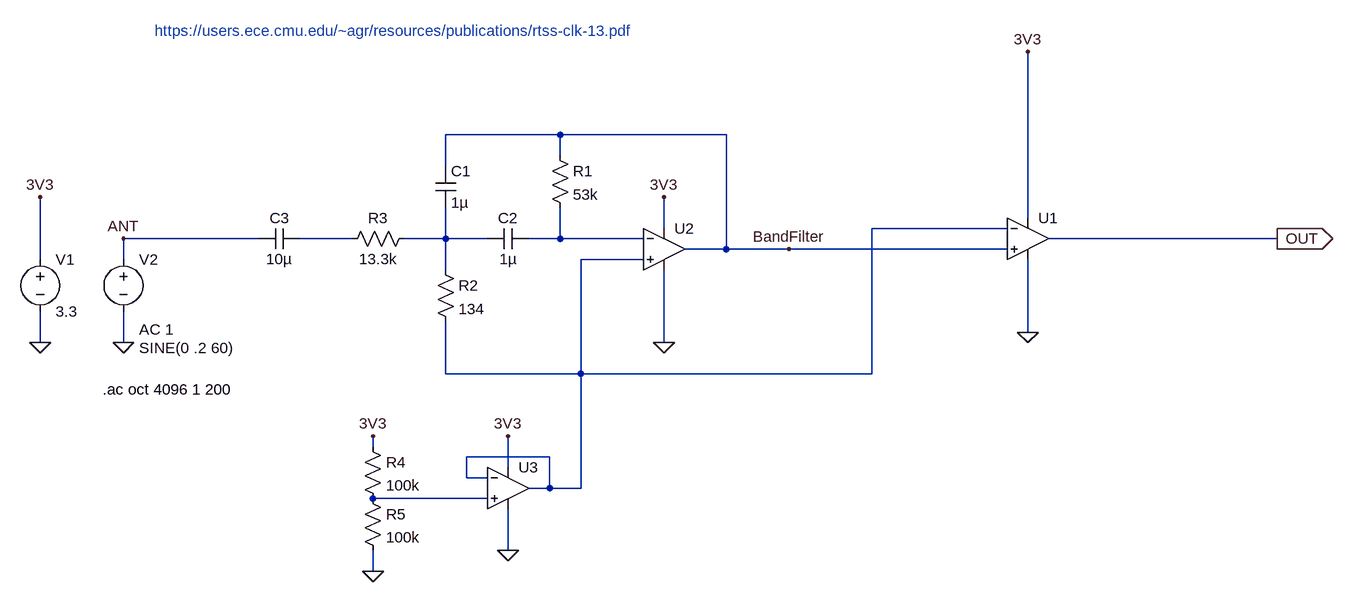
[diagram p0: schematic 60Hz Detector Simulation - Frequency Resp.asc]
60Hz Detector Simulation - Frequency Resp.asc, the LTspice schematic file:
Version 4
SHEET 1 900 836
WIRE -320 112 -496 112
WIRE -64 112 -320 112
WIRE -320 144 -320 112
WIRE -496 160 -496 112
WIRE 400 240 400 -16
WIRE -160 256 -160 208
WIRE 368 256 160 256
WIRE -784 272 -992 272
WIRE -640 272 -720 272
WIRE -496 272 -496 224
WIRE -496 272 -560 272
WIRE -432 272 -496 272
WIRE -320 272 -320 224
WIRE -320 272 -368 272
WIRE -192 272 -320 272
WIRE 784 272 432 272
WIRE -64 288 -64 112
WIRE -64 288 -128 288
WIRE 32 288 -64 288
WIRE 368 288 32 288
WIRE -1120 304 -1120 208
WIRE -992 304 -992 272
WIRE -192 304 -288 304
WIRE -496 320 -496 272
WIRE 400 416 400 304
WIRE -1120 432 -1120 384
WIRE -992 432 -992 384
WIRE -160 432 -160 320
WIRE -496 480 -496 400
WIRE -288 480 -288 304
WIRE -288 480 -496 480
WIRE 160 480 160 256
WIRE 160 480 -288 480
WIRE -608 592 -608 576
WIRE -336 608 -464 608
WIRE -400 624 -400 576
WIRE -464 640 -464 608
WIRE -432 640 -464 640
WIRE -336 656 -336 608
WIRE -336 656 -368 656
WIRE -288 656 -288 480
WIRE -288 656 -336 656
WIRE -432 672 -608 672
WIRE -400 752 -400 688
WIRE -608 784 -608 752
FLAG -1120 432 0
FLAG 400 416 0
FLAG 784 272 OUT
IOPIN 784 272 Out
FLAG -1120 208 3V3
FLAG -160 208 3V3
FLAG -160 432 0
FLAG 400 -16 3V3
FLAG -992 432 0
FLAG 32 288 BandFilter
FLAG -992 272 ANT
FLAG -400 752 0
FLAG -400 576 3V3
FLAG -608 784 0
FLAG -608 576 3V3
SYMBOL voltage -1120 288 R0
WINDOW 123 0 0 Left 2
WINDOW 39 0 0 Left 2
SYMATTR InstName V1
SYMATTR Value 3.3
SYMBOL Opamps\\UniversalOpamp2 400 272 R0
SYMATTR InstName U1
SYMBOL Opamps\\UniversalOpamp2 -160 288 R0
SYMATTR InstName U2
SYMBOL res -336 128 R0
SYMATTR InstName R1
SYMATTR Value 53k
SYMBOL cap -512 160 R0
SYMATTR InstName C1
SYMATTR Value 1µ
SYMBOL cap -432 288 R270
WINDOW 0 32 32 VTop 2
WINDOW 3 0 32 VBottom 2
SYMATTR InstName C2
SYMATTR Value 1µ
SYMBOL res -512 304 R0
SYMATTR InstName R2
SYMATTR Value 134
SYMBOL res -656 288 R270
WINDOW 0 32 56 VTop 2
WINDOW 3 0 56 VBottom 2
SYMATTR InstName R3
SYMATTR Value 13.3k
SYMBOL cap -784 288 R270
WINDOW 0 32 32 VTop 2
WINDOW 3 0 32 VBottom 2
SYMATTR InstName C3
SYMATTR Value 10µ
SYMBOL voltage -992 288 R0
WINDOW 3 24 152 Left 2
WINDOW 123 24 124 Left 2
WINDOW 39 0 0 Left 2
SYMATTR Value SINE(0 .2 60)
SYMATTR Value2 AC 1
SYMATTR InstName V2
SYMBOL Opamps\\UniversalOpamp2 -400 656 R0
SYMATTR InstName U3
SYMBOL res -624 576 R0
SYMATTR InstName R4
SYMATTR Value 100k
SYMBOL res -624 656 R0
SYMATTR InstName R5
SYMATTR Value 100k
TEXT -1024 504 Left 2 !.ac oct 4096 1 200
TEXT -944 -48 Left 2 ;https://users.ece.cmu.edu/~agr/resources/publications/rtss-clk-13.pdf

The netlist it stands for:
* 60Hz Detector Simulation - Frequency Resp.asc
V1 3V3 0 3.3
XU1 BandFilter N001 3V3 0 OUT level.2 Avol=1Meg GBW=10Meg Slew=10Meg ilimit=25m rail=0 Vos=0 phimargin=45 en=0 enk=0 in=0 ink=0 Rin=500Meg  ; pins IN+ IN- V+ V- OUT
XU2 N001 N004 3V3 0 BandFilter level.2 Avol=1Meg GBW=10Meg Slew=10Meg ilimit=25m rail=0 Vos=0 phimargin=45 en=0 enk=0 in=0 ink=0 Rin=500Meg  ; pins IN+ IN- V+ V- OUT
R1 BandFilter N004 53k
C1 BandFilter N003 1µ
C2 N003 N004 1µ
R2 N003 N001 134
R3 N002 N003 13.3k
C3 ANT N002 10µ
V2 ANT 0 SINE(0 .2 60) AC 1
XU3 N005 N001 3V3 0 N001 level.2 Avol=1Meg GBW=10Meg Slew=10Meg ilimit=25m rail=0 Vos=0 phimargin=45 en=0 enk=0 in=0 ink=0 Rin=500Meg  ; pins IN+ IN- V+ V- OUT
R4 3V3 N005 100k
R5 N005 0 100k
.ac oct 4096 1 200
* https://users.ece.cmu.edu/~agr/resources/publications/rtss-clk-13.pdf
.lib UniversalOpamps2.sub
.backanno
.end